# EAGLE design QHome (EAGLE 9.6.2)
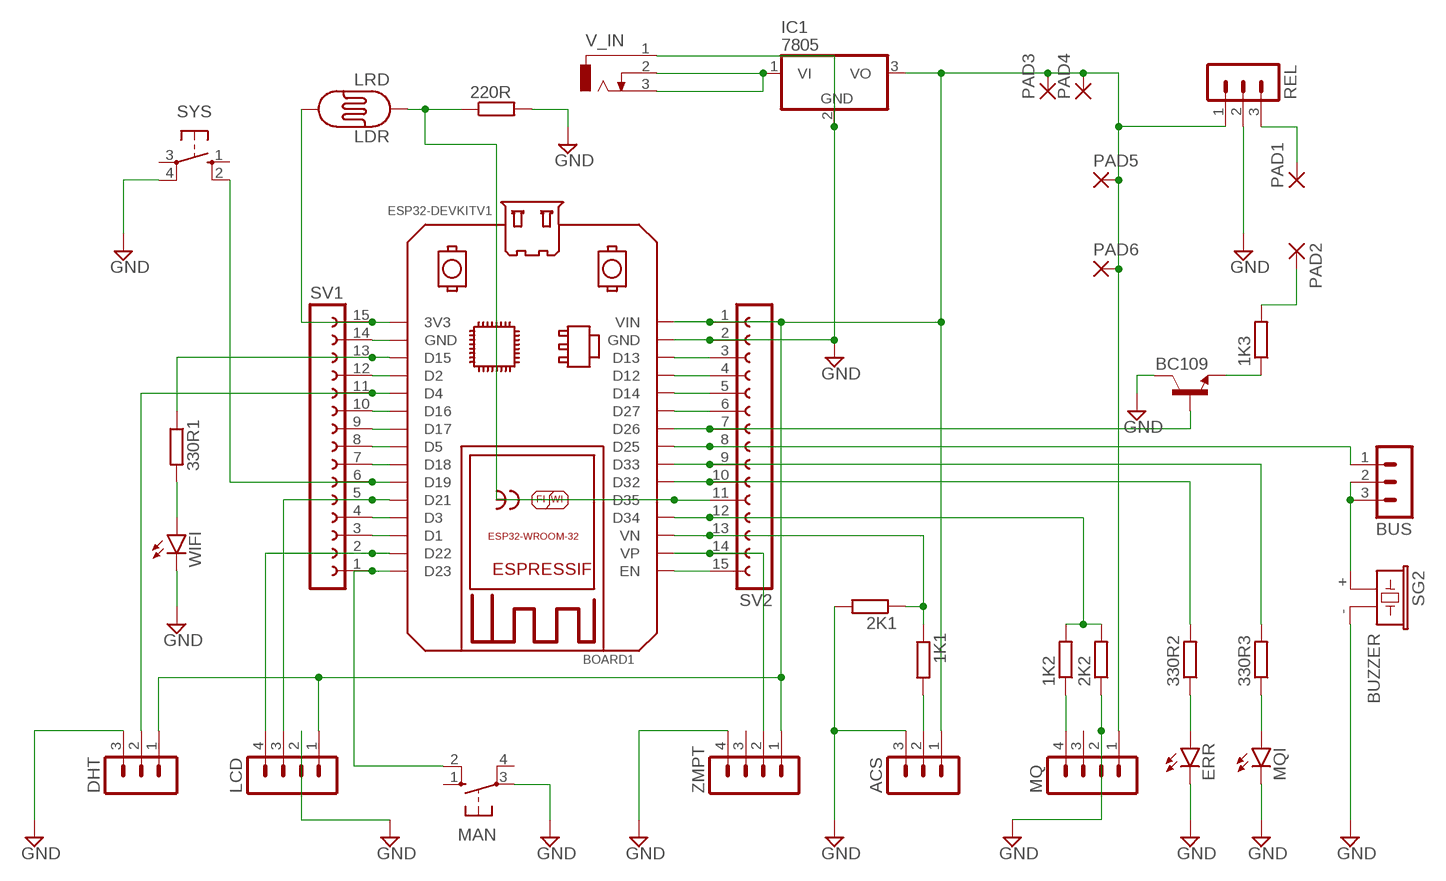
[diagram p0: schematic, sheet 1]

## Parts
1K1  R-EU_0207/7  [0207/7]
1K2  R-EU_0207/7  [0207/7]
1K3  R-EU_0207/7  [0207/7]
2K1  R-EU_0207/7  [0207/7]
2K2  R-EU_0207/7  [0207/7]
220R  R-EU_0207/7  [0207/7]
330R1  R-EU_0207/7  [0207/7]
330R2  R-EU_0207/7  [0207/7]
330R3  R-EU_0207/7  [0207/7]
ACS  MA03-1  [MA03-1]
BC109  BF422-NPN-TO92-BCE  [TO92-BCE]
BOARD1  ESP32DEVKITV1  [ESP32-DEVKITV1]
BUS  MA03-1  [MA03-1]
DHT  MA03-1  [MA03-1]
ERR  LED5MM  [LED5MM]
IC1  7805  788TV  [TO220V]
LCD  MA04-1  [MA04-1]
LDR  LRD  PHOTOCELLONB  [ON_BOARD]
MAN  10-XX  [B3F-10XX]
MQ  MA04-1  [MA04-1]
MQI  LED5MM  [LED5MM]
PAD1  2,54/1,1  [2,54/1,1]
PAD2  2,54/1,1  [2,54/1,1]
PAD3  2,54/1,1  [2,54/1,1]
PAD4  2,54/1,1  [2,54/1,1]
PAD5  2,54/1,1  [2,54/1,1]
PAD6  2,54/1,1  [2,54/1,1]
REL  MA03-1  [MA03-1]
SG2  BUZZER  F/CM12P  [F/CM12P]
SV1  FE15-1  [FE15]
SV2  FE15-1  [FE15]
SYS  10-XX  [B3F-10XX]
V_IN  DCJ0303  [DCJ0303]
WIFI  LED5MM  [LED5MM]
ZMPT  MA04-1  [MA04-1]

## Nets
GND: 2K1.2 2K2.1 220R.2 ACS.3 BC109.C BOARD1.GND DHT.3 ERR.K(C) IC1.2(GND) LCD.2 MAN.3(P) MQ.2 MQI.K(C) REL.2 SG2.- SV2.2 SYS.4(P1) V_IN.1 WIFI.K(C) ZMPT.4
N$1: IC1.1(VI) V_IN.2 V_IN.3
N$2: BOARD1.VP SV2.14 ZMPT.2
N$3: BOARD1.3V3 LDR.2 SV1.15
N$4: 1K1.1 2K1.1 BOARD1.VN SV2.13
N$5: 1K1.2 ACS.2
N$6: 1K2.1 MQ.4
N$7: ACS.1 BOARD1.VIN DHT.1 IC1.3(VO) LCD.1 MQ.1 PAD3.1(P) PAD4.1(P) PAD5.1(P) PAD6.1(P) REL.1 SV2.1 ZMPT.1
N$8: 1K2.2 2K2.2 BOARD1.D34 SV2.12
N$9: 220R.1 BOARD1.D35 LDR.1 SV2.11
N$10: BOARD1.D21 LCD.3 SV1.5
N$11: BOARD1.D22 LCD.4 SV1.2
N$12: 330R1.2 WIFI.A
N$13: BOARD1.D4 DHT.2 SV1.11
N$14: 330R2.1 ERR.A
N$15: 330R1.1 BOARD1.D15 SV1.13
N$16: 330R3.2 BOARD1.D33 SV2.9
N$17: 330R3.1 MQI.A
N$18: 330R2.2 BOARD1.D32 SV2.10
N$19: BOARD1.D25 BUS.1 SV2.8
N$20: BUS.2 BUS.3 SG2.+
N$21: 1K3.2 PAD2.1(P)
N$22: BOARD1.D19 SV1.6 SYS.2(S1)
N$23: BOARD1.D23 MAN.2(S1) SV1.1
N$24: BOARD1.D1 SV1.3
N$25: BOARD1.D3 SV1.4
N$26: BOARD1.D18 SV1.7
N$27: BOARD1.D5 SV1.8
N$28: BOARD1.D17 SV1.9
N$29: BOARD1.D16 SV1.10
N$30: BOARD1.D2 SV1.12
N$31: BOARD1.GND@1(GND) SV1.14
N$32: BOARD1.D13 SV2.3
N$33: BOARD1.D12 SV2.4
N$34: BOARD1.D14 SV2.5
N$35: BOARD1.D27 SV2.6
N$36: BOARD1.EN SV2.15
N$37: BC109.B BOARD1.D26 SV2.7
N$38: PAD1.1(P) REL.3
N$40: 1K3.1 BC109.E
Unconnected: MAN.1(S) MAN.4(P1) MQ.3 SYS.1(S) SYS.3(P) ZMPT.3

## Library data of the parts
1K1-1K3 2K1 2K2 220R 330R1-330R3 = rcl:R-EU_: RESISTOR, European symbol; SPICEPREFIX: R
ACS BUS DHT REL = con-lstb:MA03-1: PIN HEADER; OC_FARNELL: unknown; OC_NEWARK: unknown
BC109 = transistor:*-NPN-: NPN Transistror BF959 corrected 2008.03.06
BOARD1 = ESP32-DEVKITV1:ESP32DEVKITV1: https://github.com/shridattdudhat
ERR MQI WIFI = led:LED: LED OSRAM: - CHIPLED LG R971, LG N971, LY N971, LG Q971, LY Q971, LO R971, LY R971 LH N974, LH R974 LS Q976, LO Q976, LY Q976 LO Q996 - Hyper CHIPLED LW Q18S LB Q993, LB Q99A, LB R99A - SideLED LS A670, LO A670, LY A670, LG A670, LP A670 LB A673, LV A673, LT A673, LW A673 LH A674 LY A675 LS A676, LA A676, LO A676, LY A676, LW A676 LS A679, LY A679, LG A679 - Hyper Micro SIDELED® LS Y876, LA Y876, LO Y876, LY Y876 LT Y87S - SmartLED LW L88C, LW L88S LB L89C, LB L89S, LG L890 LS L89K, LO L89K, LY L89K LS L896, LA L896, LO L896, LY L896 - TOPLED LS T670, LO T670, LY T670, LG T670, LP T670 LSG T670, LSP T670, LSY T670, LOP T670, LYG T670 LG T671, LOG T671, LSG T671 LB T673, LV T673, LT T673, LW T673 LH T674 LS T676, LA T676, LO T676, LY T676, LB T676, LH T676, LSB T676, LW T676 LB T67C, LV T67C, LT T67C, LS T67K, LO T67K, LY T67K, LW E67C LS E67B, LA E67B, LO E67B, LY E67B, LB E67C, LV E67C, LT E67C LW T67C LS T679, LY T679, LG T679 LS T770, LO T770, LY T770, LG T770, LP T770 LB T773, LV T773, LT T773, LW T773 LH T774 LS E675, LA E675, LY E675, LS T675 LS T776, LA T776, LO T776, LY T776, LB T776 LHGB T686 LT T68C, LB T68C - Hyper Mini TOPLED® LB M676 - Mini TOPLED Santana® LG M470 LS M47K, LO M47K, LY M47K Source: http://www.osram.convergy.de LUXEON: - LUMILED® LXK2-PW12-R00, LXK2-PW12-S00, LXK2-PW14-U00, LXK2-PW14-V00 LXK2-PM12-R00, LXK2-PM12-S00, LXK2-PM14-U00 LXK2-PE12-Q00, LXK2-PE12-R00, LXK2-PE12-S00, LXK2-PE14-T00, LXK2-PE14-U00 LXK2-PB12-K00, LXK2-PB12-L00, LXK2-PB12-M00, LXK2-PB14-N00, LXK2-PB14-P00, LXK2-PB14-Q00 LXK2-PR12-L00, LXK2-PR12-M00, LXK2-PR14-Q00, LXK2-PR14-R00 LXK2-PD12-Q00, LXK2-PD12-R00, LXK2-PD12-S00 LXK2-PH12-R00, LXK2-PH12-S00 LXK2-PL12-P00, LXK2-PL12-Q00, LXK2-PL12-R00 Source: www.luxeon.com KINGBRIGHT: KA-3528ASYC Source: www.kingbright.com
IC1 = linear:78*: Positive VOLTAGE REGULATOR Source: http://cache.national.com/ds/LM/LM78L05.pdf http://www.fairchildsemi.com/ds/LM/LM7805.pdf
LCD MQ ZMPT = con-lstb:MA04-1: PIN HEADER; OC_FARNELL: unknown; OC_NEWARK: unknown
LDR = LDR:PHOTOCELL: Photo Resitor
MAN SYS = buttons:10-XX: OMRON SWITCH
PAD1-PAD6 = wirepad:2,54/1,1: THROUGH-HOLE PAD
SG2 = buzzer:F/CM12P: BUZZER Source: Buerklin; OC_FARNELL: unknown; OC_NEWARK: unknown
SV1 SV2 = con-lsta:FE15-1: FEMALE HEADER; OC_FARNELL: unknown; OC_NEWARK: unknown
V_IN = con-jack:DCJ0303: DC POWER JACK Source: DCJ0303.pdf; OC_FARNELL: unknown; OC_NEWARK: unknown

## Net classes
0 default: clearance 0.205 mm

## Board
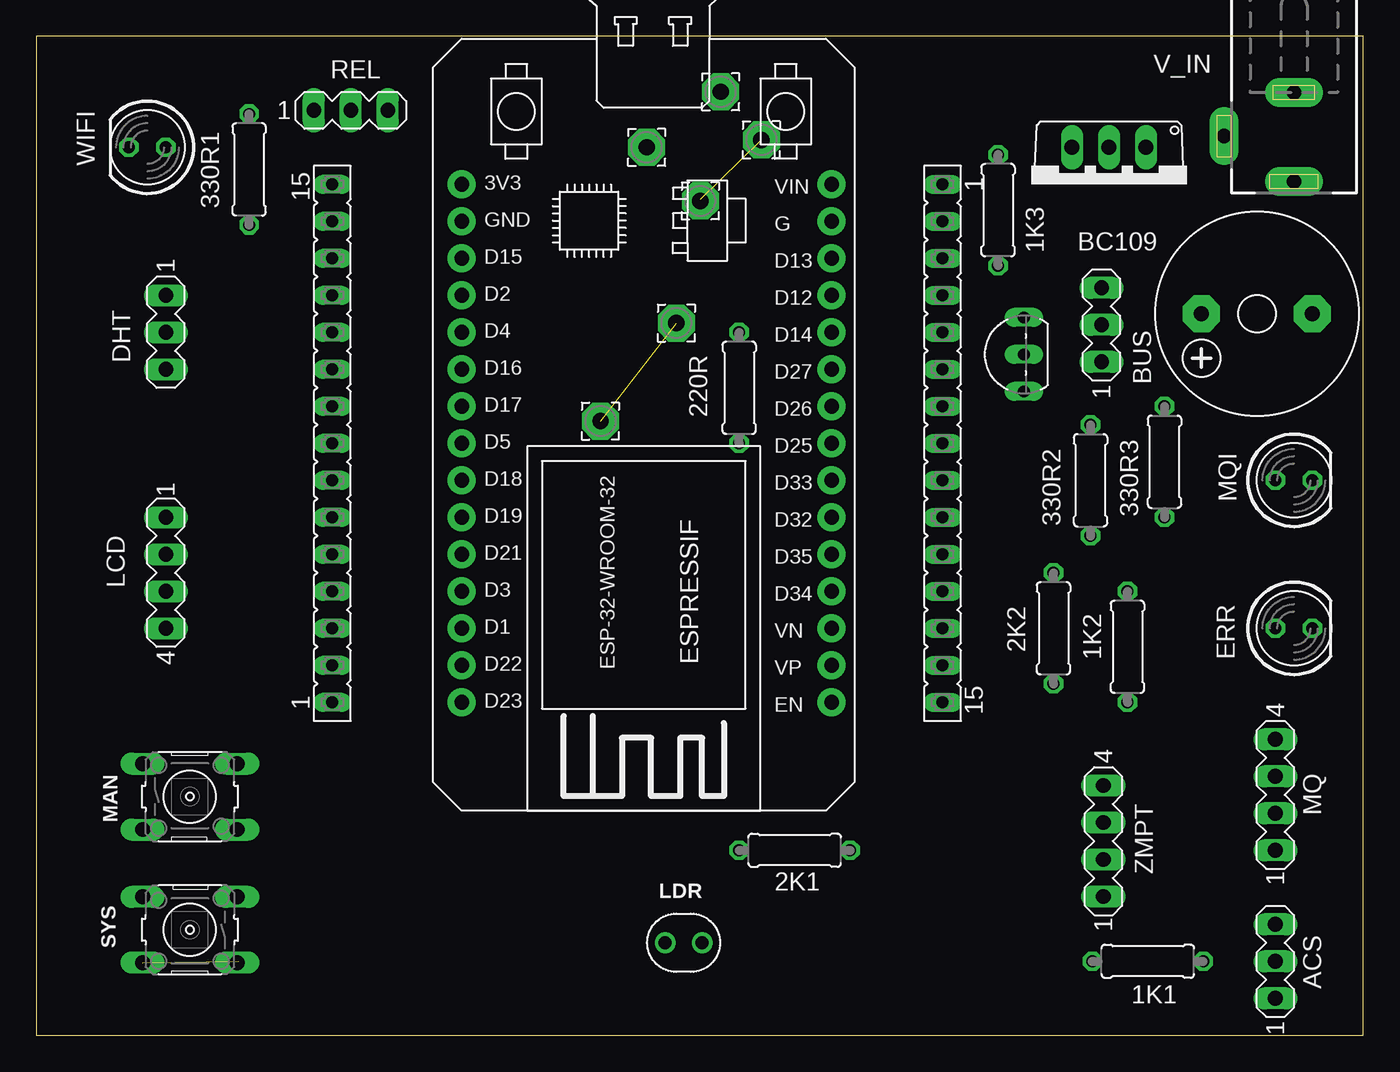
[diagram p1: board, top side]
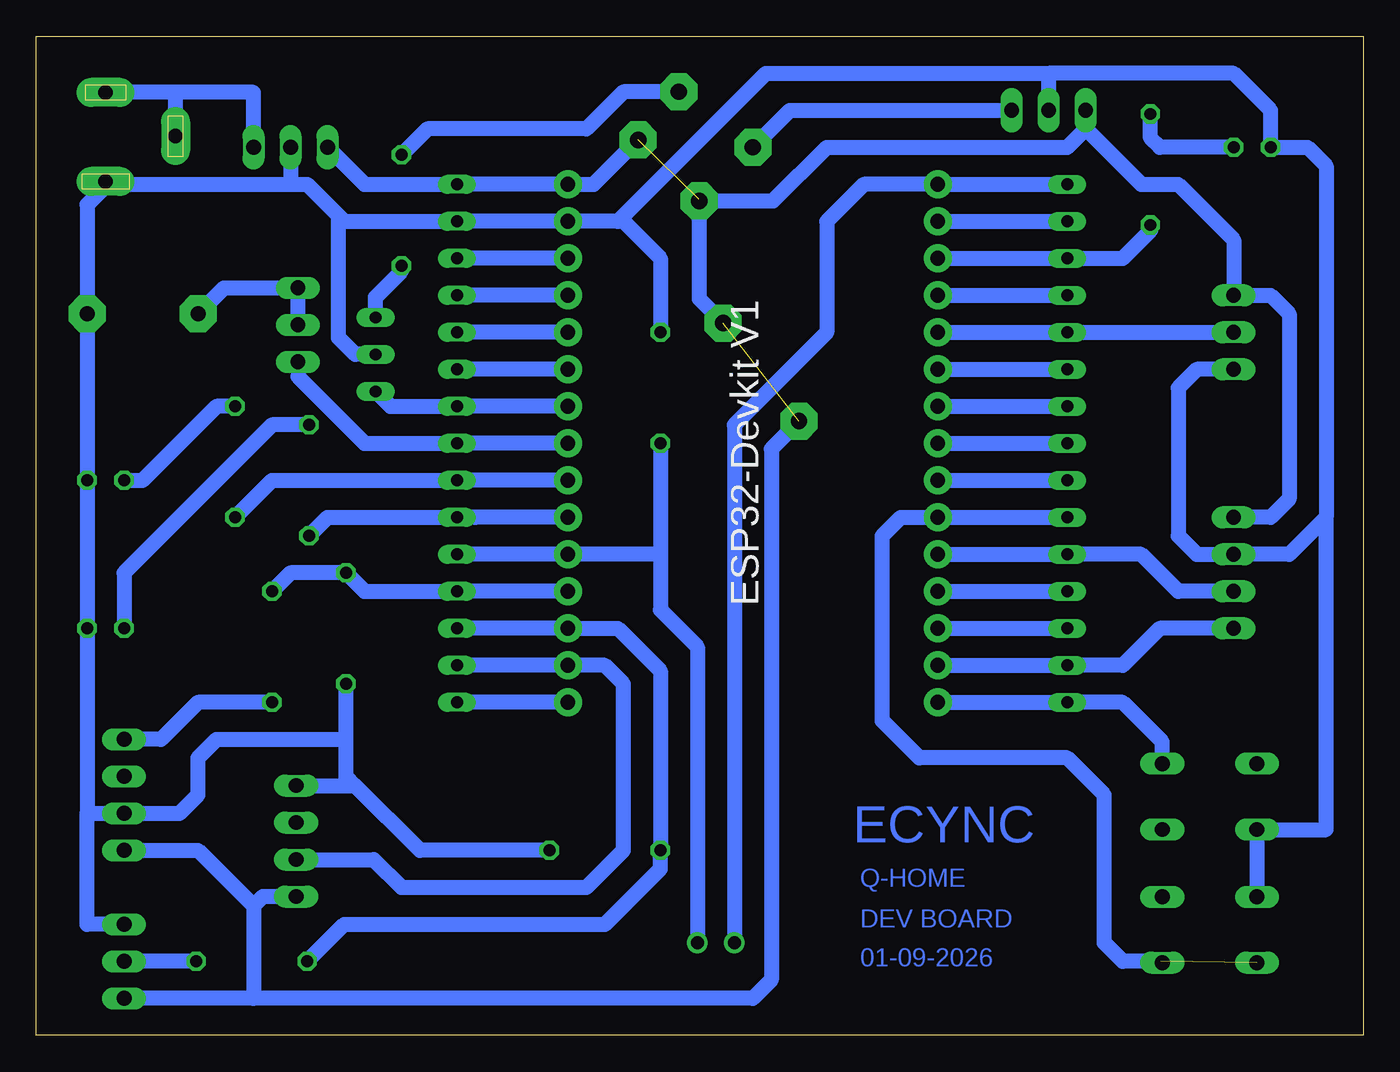
[diagram p2: board, bottom side, seen from below]

Size 91.11 x 68.57 mm. Coordinates in mm from the lower left corner, seen from the top.
Outline: 0,0 91.11,0 91.11,68.57 0,68.57 0,0
Copper layers (1*16): Top 0.035mm / dielectric 1.5mm / Bottom 0.035mm
Design rules "default": minimum track width 6mil, minimum drill 0.35mm, track to track 6mil, track to pad 6mil, pad to pad 6mil, via to via 6mil, smd to smd 6mil, copper to edge 40mil, drill to drill 6mil, minimum pad ring 10mil, minimum via ring 8mil, stop-mask expansion 4mil, vias tented up to drill 0mil, thermal gap 10mil

### Footprints (pad centres in the part's own frame; a part is rotated, then mirrored left to right if it is on the bottom)
0207/7 = drill 0.813 octagon: 1 -3.81,0; 2 3.81,0
MA03-1 = drill 1.016 long: 1 -2.54,0; 2 0,0; 3 2.54,0
TO92-BCE = drill 0.813 long: B -2.54,0; C 0,0; E 2.54,0
ESP32-DEVKITV1 = drill 1 pad 1.93: 3V3 0,0; D1 30.48,0; D2 7.62,0; D3 27.94,0; D4 10.16,0; D5 17.78,0; D12 7.62,25.4; D13 5.08,25.4; D14 10.16,25.4; D15 5.08,0; D16 12.7,0; D17 15.24,0; D18 20.32,0; D19 22.86,0; D21 25.4,0; D22 33.02,0; D23 35.56,0; D25 17.78,25.4; D26 15.24,25.4; D27 12.7,25.4; D32 22.86,25.4; D33 20.32,25.4; D34 27.94,25.4; D35 25.4,25.4; EN 35.56,25.4; GND 2.54,25.4; GND@1 2.54,0; VIN 0,25.4; VN 30.48,25.4; VP 33.02,25.4
LED5MM = drill 0.813 octagon: A -1.27,0; K 1.27,0
TO220V = drill 1.016 long: 1 -2.54,-2.54; 2 0,-2.54; 3 2.54,-2.54
MA04-1 = drill 1.016 long: 1 -3.81,0; 2 -1.27,0; 3 1.27,0; 4 3.81,0
ON_BOARD = drill 0.9: 1 -1.27,0; 2 1.27,0
B3F-10XX = drill 1.016 long: 1 -3.251,2.261; 2 3.251,2.261; 3 -3.251,-2.261; 4 3.251,-2.261
2,54/1,1 = drill 1.118 pad 2.54 octagon: 1 0,0
F/CM12P = drill 1.016 pad 2.54 octagon: + 3.81,0; - -3.81,0
FE15 = drill 0.813 long: 1 -17.78,0; 2 -15.24,0; 3 -12.7,0; 4 -10.16,0; 5 -7.62,0; 6 -5.08,0; 7 -2.54,0; 8 0,0; 9 2.54,0; 10 5.08,0; 11 7.62,0; 12 10.16,0; 13 12.7,0; 14 15.24,0; 15 17.78,0
DCJ0303 = drill 1 pad 2 long: 1 0,3.1; 2 4.8,0; 3 0,-3

### Placement (x,y rotation side)
1K1  76.33,5.08 0 top
1K2  74.93,26.67 90 top
1K3  66.04,56.64 90 top
2K1  52.07,12.7 0 top
2K2  69.85,27.94 90 top
220R  48.26,44.45 90 top
330R1  14.61,59.44 90 top
330R2  72.39,38.1 270 top
330R3  77.47,39.37 270 top
ACS  85.09,5.08 90 top
BC109  67.82,46.74 90 top
BOARD1  29.21,58.42 270 top
BUS  73.15,48.77 90 top
DHT  8.89,48.26 270 top
ERR  86.36,27.94 0 top
IC1  73.66,58.42 180 top
LCD  8.89,31.75 270 top
LDR  44.45,6.35 180 top
MAN  10.54,16.38 0 top
MQ  85.09,16.51 90 top
MQI  86.36,38.1 0 top
PAD1  41.91,60.96 0 top
PAD2  46.99,64.77 0 top
PAD3  45.59,57.28 0 top
PAD4  43.94,48.9 0 top
PAD5  38.73,42.16 0 top
PAD6  49.78,61.47 0 top
REL  21.59,63.5 0 top
SG2  83.82,49.53 180 top
SV1  20.32,40.64 90 top
SV2  62.23,40.64 270 top
SYS  10.54,7.24 180 top
V_IN  86.36,61.72 180 top
WIFI  7.62,60.96 180 top
ZMPT  73.28,13.34 90 top

### Tracks (layer width: path | path; a pad name or v marks a point on that pad's centre or on a via)
GND
  Bottom 1.016: 69.21,17.14 64.77,12.7 2K1.2 | 69.21,17.14 69.85,17.78 69.85,20.32 | 69.85,20.32 2K2.1 | 87.63,15.24 ERR.K MQI.K SG2.- 87.63,57.02 86.36,58.29 V_IN.1 86.16,58.42 73.66,58.42 | 87.63,15.24 MQ.2 81.28,15.24 80.01,16.51 80.01,19.05 78.74,20.32 69.85,20.32 | ACS.3 87.63,7.62 87.63,15.24 | ZMPT.4 69.21,17.14 | DHT.3 11.43,45.72 12.7,44.45 12.7,34.29 11.43,33.02 LCD.2 5.08,33.02 2.54,35.56 | 2.54,35.56 2.54,59.69 3.81,60.96 WIFI.K 6.35,63.5 8.89,66.04 21.59,66.04 | 2.54,35.56 2.54,14.12 MAN.3 SYS.4 | 220R.2 48.26,53.34 50.8,55.88 51.18,55.88 | REL.2 21.59,66.04 | 51.18,55.88 BOARD1.GND SV2.2 69.98,55.88 70.36,56.26 | 51.18,55.88 41.02,66.04 21.59,66.04 | IC1.2 73.66,58.42 | 73.66,58.42 72.52,58.42 70.55,56.45 70.36,56.26 | BC109.C 69.21,46.74 70.36,47.88 70.36,56.26
N$1
  Bottom 1.016: IC1.1 76.2,64.72 81.28,64.72 | 81.28,64.72 V_IN.3 | V_IN.2 81.56,64.44 81.28,64.72
N$2
  Bottom 1.016: SV2.14 BOARD1.VP 52.07,25.4 50.8,24.13 50.8,12.7 53.34,10.16 66.04,10.16 67.94,12.07 ZMPT.2
N$3
  Bottom 1.016: SV1.15 BOARD1.3V3 34.29,58.42 36.83,55.88 36.83,48.26 43.18,41.91 LDR.2
N$4
  Bottom 1.016: SV2.13 BOARD1.VN 51.18,27.94 48.26,25.02 2K1.1 48.26,11.43 52.07,7.62 69.98,7.62 1K1.1
N$5
  Bottom 1.016: 1K1.2 ACS.2
N$6
  Bottom 1.016: MQ.4 82.55,20.32 80.01,22.86 1K2.1
N$7  (2 unrouted)
  Bottom 1.016: IC1.3 68.58,58.42 SV2.1 BOARD1.VIN 52.83,58.42 PAD6.1 | 76.2,8.89 80.01,12.7 MQ.1 | 76.2,2.54 ACS.1 | 76.2,8.89 76.2,2.54 | ZMPT.1 75.56,9.52 76.2,8.89 | LCD.1 6.35,35.56 5.08,36.83 5.08,49.53 6.35,50.8 DHT.1 8.89,54.61 12.7,58.42 15.24,58.42 19.05,62.23 | 45.59,57.4 PAD3.1 | PAD3.1 45.59,50.55 PAD4.1 | PAD5.1 40.64,40.26 40.64,3.81 41.91,2.54 76.2,2.54 | PAD3.1 40.51,57.28 36.83,60.96 20.32,60.96 19.05,62.23 | 19.05,62.23 REL.1
N$8
  Bottom 1.016: BOARD1.D34 SV2.12 68.58,30.48 2K2.2 73.66,31.75 1K2.2
N$9
  Bottom 1.016: SV2.11 BOARD1.D35 48.26,33.02 220R.1 48.26,29.21 45.72,26.67 LDR.1
N$10
  Bottom 1.016: BOARD1.D21 SV1.5 15.24,33.02 12.7,30.48 LCD.3
N$11
  Bottom 1.016: BOARD1.D22 SV1.2 16.51,25.4 13.97,27.94 LCD.4
N$12
  Bottom 1.016: 330R1.2 14.61,61.6 13.97,60.96 WIFI.A
N$13
  Bottom 1.016: BOARD1.D4 SV1.11 DHT.2
N$14
  Bottom 1.016: 330R2.1 74.93,41.91 85.09,31.75 ERR.A
N$15
  Bottom 1.016: BOARD1.D15 SV1.13 16.51,53.34 14.61,55.24 330R1.1
N$16
  Bottom 1.016: BOARD1.D33 SV2.9 74.93,38.1 330R3.2
N$17
  Bottom 1.016: MQI.A 83.82,38.1 78.74,43.18 330R3.1
N$18
  Bottom 1.016: BOARD1.D32 60.96,35.56 SV2.10 71.12,35.56 330R2.2
N$19
  Bottom 1.016: BOARD1.D25 SV2.8 68.58,40.64 73.15,45.21 BUS.1
N$20
  Bottom 1.016: BUS.2 BUS.3 78.23,51.31 SG2.+
N$21
  Bottom 1.016: PAD2.1 50.8,64.77 53.34,62.23 64.26,62.23 1K3.2
N$22  (1 unrouted)
  Bottom 1.016: SV1.6 BOARD1.D19 31.75,35.56 33.02,34.29 33.02,21.59 30.48,19.05 20.32,19.05 17.78,16.51 17.78,6.35 16.51,5.08 13.89,5.08
N$23
  Bottom 1.016: BOARD1.D23 SV1.1 16.51,22.86 13.79,20.14 13.79,19.05 | MAN.2 13.79,19.05 | 13.39,18.64 13.79,19.05
N$24
  Bottom 1.016: BOARD1.D1 SV1.3
N$25
  Bottom 1.016: BOARD1.D3 SV1.4
N$26
  Bottom 1.016: BOARD1.D18 SV1.7
N$27
  Bottom 1.016: BOARD1.D5 SV1.8
N$28
  Bottom 1.016: BOARD1.D17 SV1.9
N$29
  Bottom 1.016: BOARD1.D16 SV1.10
N$30
  Bottom 1.016: BOARD1.D2 SV1.12
N$31
  Bottom 1.016: BOARD1.GND@1 SV1.14
N$32
  Bottom 1.016: BOARD1.D13 SV2.3
N$33
  Bottom 1.016: BOARD1.D12 SV2.4
N$34
  Bottom 1.016: BOARD1.D14 SV2.5
N$35
  Bottom 1.016: BOARD1.D27 SV2.6
N$36
  Bottom 1.016: BOARD1.EN SV2.15
N$37
  Bottom 1.016: BOARD1.D26 SV2.7 66.8,43.18 BC109.B
N$38
  Bottom 1.016: PAD1.1 39.37,63.5 REL.3
N$40
  Bottom 1.016: BC109.E 67.82,50.67 66.04,52.45 1K3.1

### Text on the board
Bottom: ECYNC | Q-HOME | DEV BOARD | 01-09-2026